# EAGLE design lightAlarm_v4 (EAGLE 8.4.1)

## Sheet 1 of 2
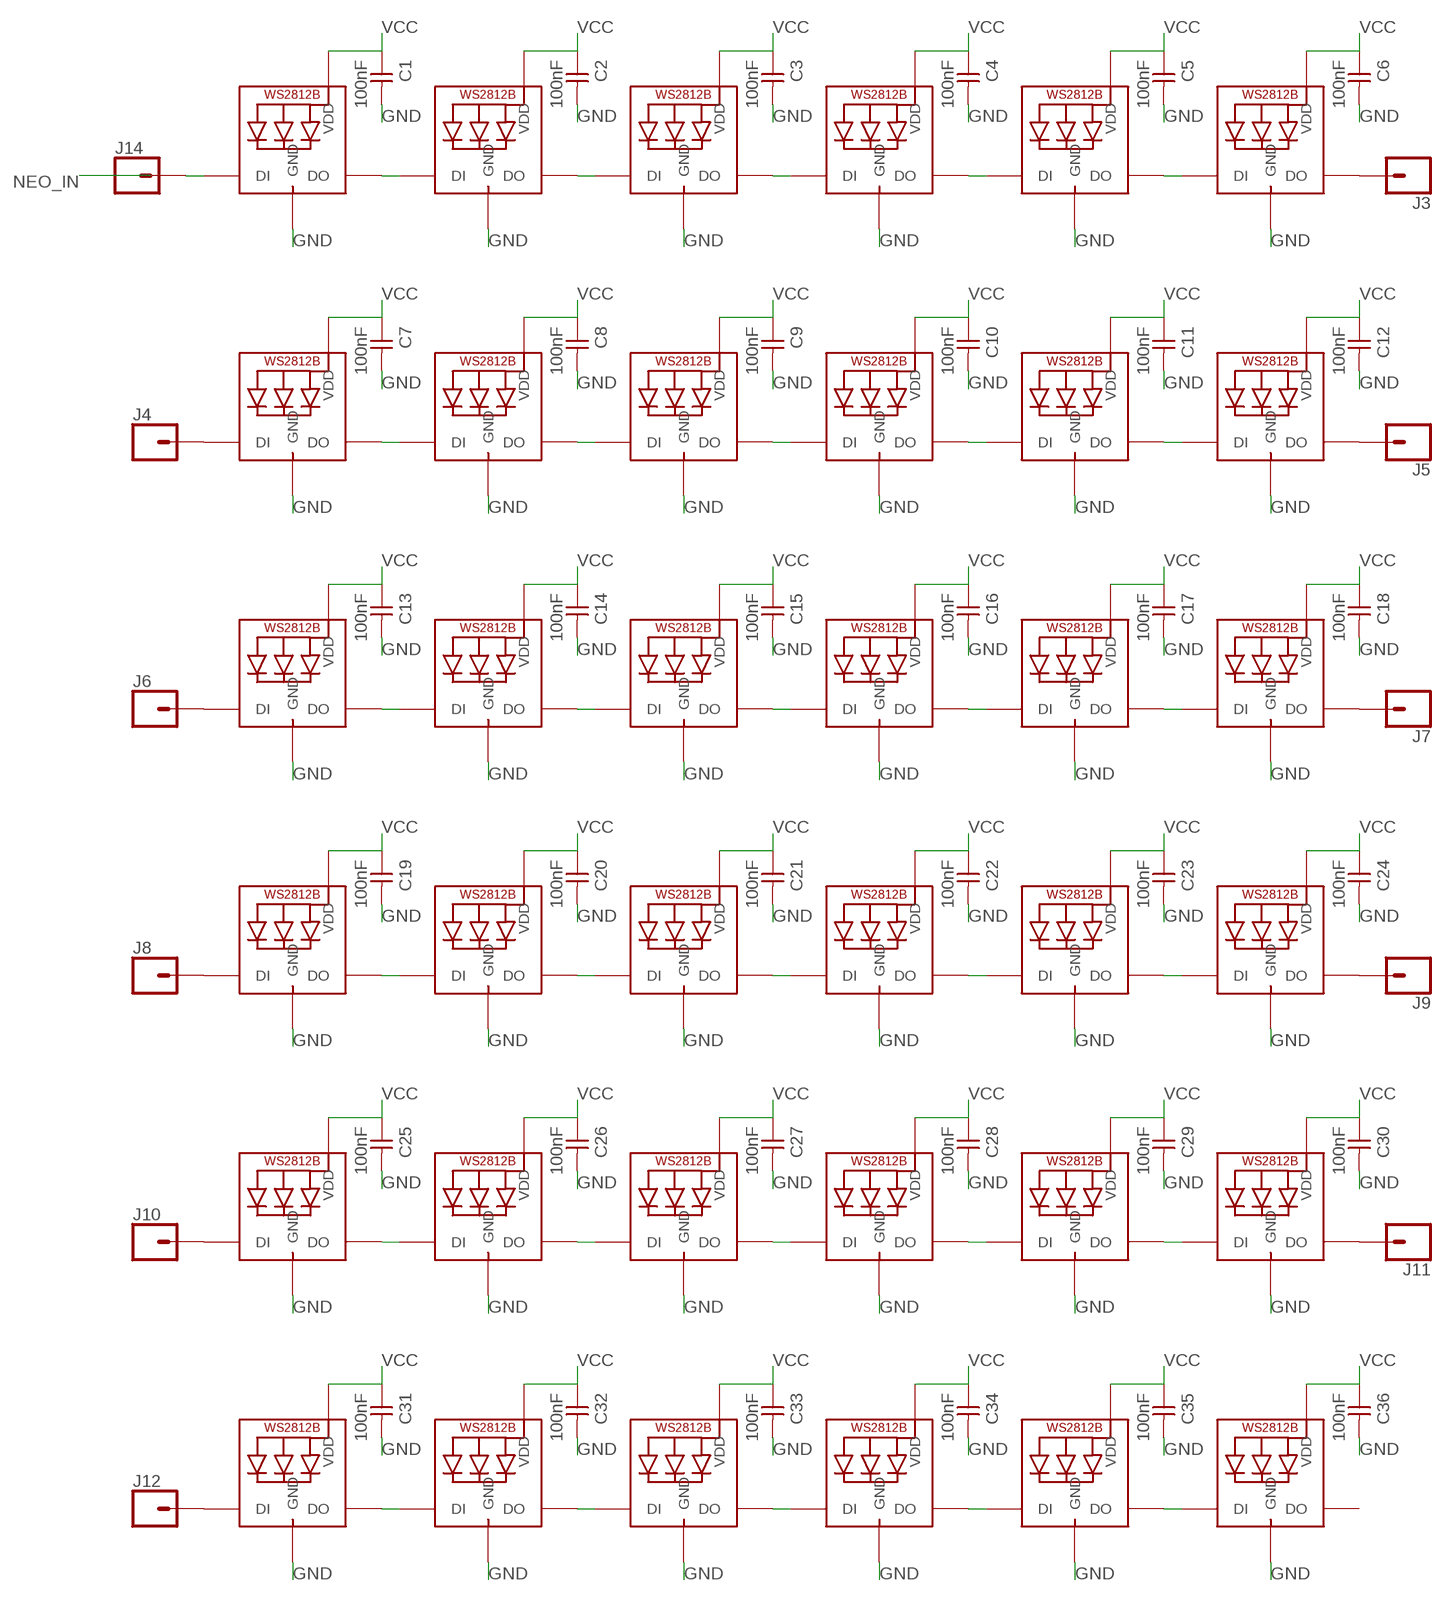
[diagram p0: schematic, sheet 1]

### Parts
C1  100nF  UNPOLARIZED_CAPACITOR1206  [1206]
C2  100nF  UNPOLARIZED_CAPACITOR1206  [1206]
C3  100nF  UNPOLARIZED_CAPACITOR1206  [1206]
C4  100nF  UNPOLARIZED_CAPACITOR1206  [1206]
C5  100nF  UNPOLARIZED_CAPACITOR1206  [1206]
C6  100nF  UNPOLARIZED_CAPACITOR1206  [1206]
C7  100nF  UNPOLARIZED_CAPACITOR1206  [1206]
C8  100nF  UNPOLARIZED_CAPACITOR1206  [1206]
C9  100nF  UNPOLARIZED_CAPACITOR1206  [1206]
C10  100nF  UNPOLARIZED_CAPACITOR1206  [1206]
C11  100nF  UNPOLARIZED_CAPACITOR1206  [1206]
C12  100nF  UNPOLARIZED_CAPACITOR1206  [1206]
C13  100nF  UNPOLARIZED_CAPACITOR1206  [1206]
C14  100nF  UNPOLARIZED_CAPACITOR1206  [1206]
C15  100nF  UNPOLARIZED_CAPACITOR1206  [1206]
C16  100nF  UNPOLARIZED_CAPACITOR1206  [1206]
C17  100nF  UNPOLARIZED_CAPACITOR1206  [1206]
C18  100nF  UNPOLARIZED_CAPACITOR1206  [1206]
C19  100nF  UNPOLARIZED_CAPACITOR1206  [1206]
C20  100nF  UNPOLARIZED_CAPACITOR1206  [1206]
C21  100nF  UNPOLARIZED_CAPACITOR1206  [1206]
C22  100nF  UNPOLARIZED_CAPACITOR1206  [1206]
C23  100nF  UNPOLARIZED_CAPACITOR1206  [1206]
C24  100nF  UNPOLARIZED_CAPACITOR1206  [1206]
C25  100nF  UNPOLARIZED_CAPACITOR1206  [1206]
C26  100nF  UNPOLARIZED_CAPACITOR1206  [1206]
C27  100nF  UNPOLARIZED_CAPACITOR1206  [1206]
C28  100nF  UNPOLARIZED_CAPACITOR1206  [1206]
C29  100nF  UNPOLARIZED_CAPACITOR1206  [1206]
C30  100nF  UNPOLARIZED_CAPACITOR1206  [1206]
C31  100nF  UNPOLARIZED_CAPACITOR1206  [1206]
C32  100nF  UNPOLARIZED_CAPACITOR1206  [1206]
C33  100nF  UNPOLARIZED_CAPACITOR1206  [1206]
C34  100nF  UNPOLARIZED_CAPACITOR1206  [1206]
C35  100nF  UNPOLARIZED_CAPACITOR1206  [1206]
C36  100nF  UNPOLARIZED_CAPACITOR1206  [1206]
J3  CONN_01PTH_LONGPAD  [1X01_LONGPAD]
J4  CONN_01PTH_LONGPAD  [1X01_LONGPAD]
J5  CONN_01PTH_LONGPAD  [1X01_LONGPAD]
J6  CONN_01PTH_LONGPAD  [1X01_LONGPAD]
J7  CONN_01PTH_LONGPAD  [1X01_LONGPAD]
J8  CONN_01PTH_LONGPAD  [1X01_LONGPAD]
J9  CONN_01PTH_LONGPAD  [1X01_LONGPAD]
J10  CONN_01PTH_LONGPAD  [1X01_LONGPAD]
J11  CONN_01PTH_LONGPAD  [1X01_LONGPAD]
J12  CONN_01PTH_LONGPAD  [1X01_LONGPAD]
J14  CONN_01PTH_LONGPAD  [1X01_LONGPAD]
LED1  WS2812B5050  [WS2812B]
LED2  WS2812B5050  [WS2812B]
LED3  WS2812B5050  [WS2812B]
LED4  WS2812B5050  [WS2812B]
LED5  WS2812B5050  [WS2812B]
LED6  WS2812B5050  [WS2812B]
LED7  WS2812B5050  [WS2812B]
LED8  WS2812B5050  [WS2812B]
LED9  WS2812B5050  [WS2812B]
LED10  WS2812B5050  [WS2812B]
LED11  WS2812B5050  [WS2812B]
LED12  WS2812B5050  [WS2812B]
LED13  WS2812B5050  [WS2812B]
LED14  WS2812B5050  [WS2812B]
LED15  WS2812B5050  [WS2812B]
LED16  WS2812B5050  [WS2812B]
LED17  WS2812B5050  [WS2812B]
LED18  WS2812B5050  [WS2812B]
LED19  WS2812B5050  [WS2812B]
LED20  WS2812B5050  [WS2812B]
LED21  WS2812B5050  [WS2812B]
LED22  WS2812B5050  [WS2812B]
LED23  WS2812B5050  [WS2812B]
LED24  WS2812B5050  [WS2812B]
LED25  WS2812B5050  [WS2812B]
LED26  WS2812B5050  [WS2812B]
LED27  WS2812B5050  [WS2812B]
LED28  WS2812B5050  [WS2812B]
LED29  WS2812B5050  [WS2812B]
LED30  WS2812B5050  [WS2812B]
LED31  WS2812B5050  [WS2812B]
LED32  WS2812B5050  [WS2812B]
LED33  WS2812B5050  [WS2812B]
LED34  WS2812B5050  [WS2812B]
LED35  WS2812B5050  [WS2812B]
LED36  WS2812B5050  [WS2812B]

### Nets
GND: C1.2 C2.2 C3.2 C4.2 C5.2 C6.2 C7.2 C8.2 C9.2 C10.2 C11.2 C12.2 C13.2 C14.2 C15.2 C16.2 C17.2 C18.2 C19.2 C20.2 C21.2 C22.2 C23.2 C24.2 C25.2 C26.2 C27.2 C28.2 C29.2 C30.2 C31.2 C32.2 C33.2 C34.2 C35.2 C36.2 LED1.3-GND(GND) LED2.3-GND(GND) LED3.3-GND(GND) LED4.3-GND(GND) LED5.3-GND(GND) LED6.3-GND(GND) LED7.3-GND(GND) LED8.3-GND(GND) LED9.3-GND(GND) LED10.3-GND(GND) LED11.3-GND(GND) LED12.3-GND(GND) LED13.3-GND(GND) LED14.3-GND(GND) LED15.3-GND(GND) LED16.3-GND(GND) LED17.3-GND(GND) LED18.3-GND(GND) LED19.3-GND(GND) LED20.3-GND(GND) LED21.3-GND(GND) LED22.3-GND(GND) LED23.3-GND(GND) LED24.3-GND(GND) LED25.3-GND(GND) LED26.3-GND(GND) LED27.3-GND(GND) LED28.3-GND(GND) LED29.3-GND(GND) LED30.3-GND(GND) LED31.3-GND(GND) LED32.3-GND(GND) LED33.3-GND(GND) LED34.3-GND(GND) LED35.3-GND(GND) LED36.3-GND(GND) ; also sheet 2
N$1: LED1.2-DOUT(DO) LED2.4-DIN(DI)
N$2: LED3.2-DOUT(DO) LED4.4-DIN(DI)
N$3: LED2.2-DOUT(DO) LED3.4-DIN(DI)
N$4: LED5.2-DOUT(DO) LED6.4-DIN(DI)
N$5: LED4.2-DOUT(DO) LED5.4-DIN(DI)
N$6: LED7.2-DOUT(DO) LED8.4-DIN(DI)
N$7: LED9.2-DOUT(DO) LED10.4-DIN(DI)
N$8: LED8.2-DOUT(DO) LED9.4-DIN(DI)
N$9: LED11.2-DOUT(DO) LED12.4-DIN(DI)
N$10: LED10.2-DOUT(DO) LED11.4-DIN(DI)
N$12: LED13.2-DOUT(DO) LED14.4-DIN(DI)
N$13: LED15.2-DOUT(DO) LED16.4-DIN(DI)
N$14: LED14.2-DOUT(DO) LED15.4-DIN(DI)
N$15: LED17.2-DOUT(DO) LED18.4-DIN(DI)
N$16: LED16.2-DOUT(DO) LED17.4-DIN(DI)
N$17: LED19.2-DOUT(DO) LED20.4-DIN(DI)
N$18: LED21.2-DOUT(DO) LED22.4-DIN(DI)
N$19: LED20.2-DOUT(DO) LED21.4-DIN(DI)
N$20: LED23.2-DOUT(DO) LED24.4-DIN(DI)
N$21: LED22.2-DOUT(DO) LED23.4-DIN(DI)
N$22: LED25.2-DOUT(DO) LED26.4-DIN(DI)
N$23: LED27.2-DOUT(DO) LED28.4-DIN(DI)
N$24: LED26.2-DOUT(DO) LED27.4-DIN(DI)
N$25: LED29.2-DOUT(DO) LED30.4-DIN(DI)
N$26: LED28.2-DOUT(DO) LED29.4-DIN(DI)
N$27: LED31.2-DOUT(DO) LED32.4-DIN(DI)
N$28: LED33.2-DOUT(DO) LED34.4-DIN(DI)
N$29: LED32.2-DOUT(DO) LED33.4-DIN(DI)
N$30: LED35.2-DOUT(DO) LED36.4-DIN(DI)
N$31: LED34.2-DOUT(DO) LED35.4-DIN(DI)
N$50: J3.1 LED6.2-DOUT(DO)
N$51: J5.1 LED12.2-DOUT(DO)
N$52: J6.1 LED13.4-DIN(DI)
N$53: J7.1 LED18.2-DOUT(DO)
N$54: J8.1 LED19.4-DIN(DI)
N$55: J9.1 LED24.2-DOUT(DO)
N$56: J10.1 LED25.4-DIN(DI)
N$57: J11.1 LED30.2-DOUT(DO)
N$58: J12.1 LED31.4-DIN(DI)
N$68: J14.1 LED1.4-DIN(DI)
ROW1: J4.1 LED7.4-DIN(DI)
VCC: C1.1 C2.1 C3.1 C4.1 C5.1 C6.1 C7.1 C8.1 C9.1 C10.1 C11.1 C12.1 C13.1 C14.1 C15.1 C16.1 C17.1 C18.1 C19.1 C20.1 C21.1 C22.1 C23.1 C24.1 C25.1 C26.1 C27.1 C28.1 C29.1 C30.1 C31.1 C32.1 C33.1 C34.1 C35.1 C36.1 LED1.1-VDD(VDD) LED2.1-VDD(VDD) LED3.1-VDD(VDD) LED4.1-VDD(VDD) LED5.1-VDD(VDD) LED6.1-VDD(VDD) LED7.1-VDD(VDD) LED8.1-VDD(VDD) LED9.1-VDD(VDD) LED10.1-VDD(VDD) LED11.1-VDD(VDD) LED12.1-VDD(VDD) LED13.1-VDD(VDD) LED14.1-VDD(VDD) LED15.1-VDD(VDD) LED16.1-VDD(VDD) LED17.1-VDD(VDD) LED18.1-VDD(VDD) LED19.1-VDD(VDD) LED20.1-VDD(VDD) LED21.1-VDD(VDD) LED22.1-VDD(VDD) LED23.1-VDD(VDD) LED24.1-VDD(VDD) LED25.1-VDD(VDD) LED26.1-VDD(VDD) LED27.1-VDD(VDD) LED28.1-VDD(VDD) LED29.1-VDD(VDD) LED30.1-VDD(VDD) LED31.1-VDD(VDD) LED32.1-VDD(VDD) LED33.1-VDD(VDD) LED34.1-VDD(VDD) LED35.1-VDD(VDD) LED36.1-VDD(VDD) ; also sheet 2
Unconnected: LED36.2-DOUT(DO)

## Sheet 2 of 2
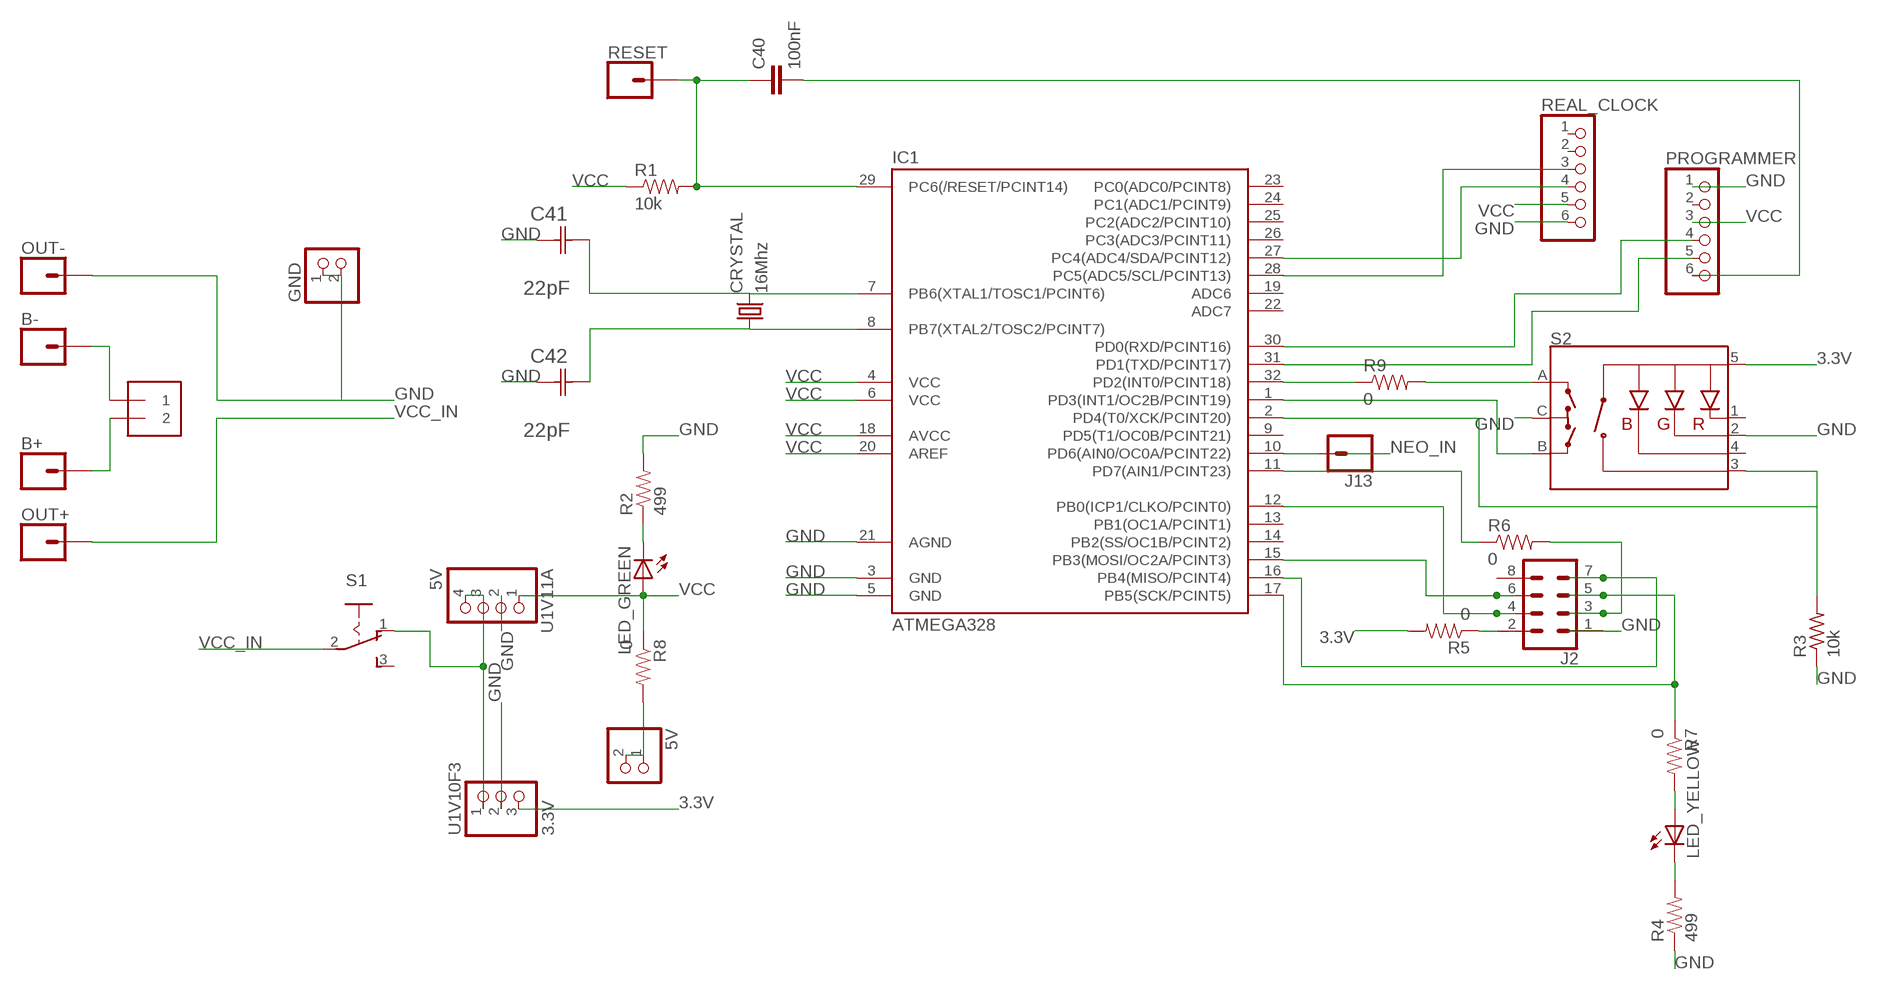
[diagram p1: schematic, sheet 2]

### Parts
5V  PINHD-1X2  [1X02]
B+  CONN_01PTH_LONGPAD  [1X01_LONGPAD]
B-  CONN_01PTH_LONGPAD  [1X01_LONGPAD]
C40  100nF  CAP1206  [1206]
C41  22pF  0612ZC225MAT2A  [CAPC3216X178N]
C42  22pF  0612ZC225MAT2A  [CAPC3216X178N]
CRYSTAL  16Mhz  CSM-7X-DU  [CSM-7X-DU]
GND  PINHD-1X2  [1X02]
IC1  ATMEGA328  ATMEGA48/88/168-AU  [TQFP32-08]
J1  1X2-3.5MM  [1X2-3.5MM]
J2  CONN_04X2  [2X4]
J13  CONN_01PTH_LONGPAD  [1X01_LONGPAD]
LED_GREEN  LED1206  [1206]
LED_YELLOW  LED1206  [1206]
OUT+  CONN_01PTH_LONGPAD  [1X01_LONGPAD]
OUT-  CONN_01PTH_LONGPAD  [1X01_LONGPAD]
PROGRAMMER  PINHD-1X6  [1X06]
R1  10k  RESISTOR1206  [1206]
R2  499  RESISTOR1206  [1206]
R3  10k  RESISTOR1206  [1206]
R4  499  RESISTOR1206  [1206]
R5  0  RESISTOR1206  [1206]
R6  0  RESISTOR1206  [1206]
R7  0  RESISTOR1206  [1206]
R8  0  RESISTOR1206  [1206]
R9  0  RESISTOR1206  [1206]
REAL_CLOCK  PINHD-1X6  [1X06]
RESET  CONN_01PTH_LONGPAD  [1X01_LONGPAD]
S1  255SB  [255SB]
S2  ENCODER-RGB-SWITCH  [ENCODER_LED_3]
U1V10F3  3.3V  PINHD-1X3  [1X03]
U1V11A  5V  PINHD-1X4  [1X04]

### Nets
3.3V: J2.2 R5.1 R5.2 S2.5(+) U1V10F3.3
GND: C41.1(C1) C42.1(C1) GND.1 GND.2 IC1.21(AGND) J2.1 OUT-.1 PROGRAMMER.1 R2.2 R3.1 R4.1 REAL_CLOCK.6 S2.2(-G) S2.C U1V10F3.2 U1V11A.2 ; also sheet 1
N$11: B+.1 J1.2
N$32: LED_GREEN.2(C) R2.1
N$33: S1.1(O) U1V10F3.1 U1V11A.3 U1V11A.4
N$34: C41.2(C2) CRYSTAL.2 IC1.7(PB6(XTAL1/TOSC1/PCINT6))
N$35: C42.2(C2) CRYSTAL.1 IC1.8(PB7(XTAL2/TOSC2/PCINT7))
N$36: IC1.11(PD7(AIN1/PCINT23)) R6.1
N$37: IC1.12(PB0(ICP1/CLKO/PCINT0)) J2.4
N$38: IC1.17(PB5(SCK/PCINT5)) J2.5 LED_YELLOW.1(A) R7.1 R7.2
N$39: IC1.15(PB3(MOSI/OC2A/PCINT3)) J2.6
N$40: IC1.16(PB4(MISO/PCINT4)) J2.7
N$41: B-.1 J1.1
N$42: IC1.27(PC4(ADC4/SDA/PCINT12)) REAL_CLOCK.4
N$43: IC1.28(PC5(ADC5/SCL/PCINT13)) REAL_CLOCK.3
N$44: IC1.30(PD0(RXD/PCINT16)) PROGRAMMER.4
N$45: IC1.31(PD1(TXD/PCINT17)) PROGRAMMER.5
N$46: IC1.32(PD2(INT0/PCINT18)) R9.1 R9.2 S2.A
N$47: IC1.1(PD3(INT1/OC2B/PCINT19)) S2.B
N$48: IC1.2(PD4(T0/XCK/PCINT20)) R3.2 S2.3(SW)
N$49: LED_YELLOW.2(C) R4.2
N$59: J2.3 R6.2
N$61: C40.1 R1.2 RESET.1
N$65: C40.2 PROGRAMMER.6
N$66: IC1.10(PD6(AIN0/OC0A/PCINT22)) J13.1
VCC: 5V.1 5V.2 IC1.4(VCC) LED_GREEN.1(A) PROGRAMMER.3 R1.1 R8.1 R8.2 REAL_CLOCK.5 U1V11A.1 ; also sheet 1
VCC_IN: OUT+.1 S1.2(P)
Unconnected: IC1.9(PD5(T1/OC0B/PCINT21)) IC1.13(PB1(OC1A/PCINT1)) IC1.14(PB2(SS/OC1B/PCINT2)) IC1.18(AVCC) IC1.19(ADC6) IC1.20(AREF) IC1.22(ADC7) IC1.23(PC0(ADC0/PCINT8)) IC1.24(PC1(ADC1/PCINT9)) IC1.25(PC2(ADC2/PCINT10)) IC1.26(PC3(ADC3/PCINT11)) IC1.29(PC6(/RESET/PCINT14)) J2.8 PROGRAMMER.2 REAL_CLOCK.1 REAL_CLOCK.2 S1.3(S) S2.1(-R) S2.4(-B)

## Power pins joined to a net without a drawn wire
GND: IC1.3(GND) IC1.5(GND)
VCC: IC1.6(VCC)

## Library data of the parts
5V GND = pinhead:PINHD-1X2: PIN HEADER
B+ B- J3-J14 OUT+ OUT- RESET = SparkFun-Connectors:CONN_01: Single connection point. Often used as Generic Header-pin footprint for 0.1 inch spaced/style header connections On any of the 0.1 inch spaced packages, you can populate with these: Break Away Headers - Straight <https://www.sparkfun.com/products/116> (PRT-00116) Break Away Male Headers - Right Angle <https://www.sparkfun.com/products/553> (PRT-00553) Female Headers <https://www.sparkfun.com/products/115> (PRT-00115) Break Away Headers - Machine Pin <https://www.sparkfun.com/products/117> (PRT-00117) Break Away Female Headers - Swiss Machine Pin <https://www.sparkfun.com/products/743> (PRT-00743) This device is also useful as a general connection point to wire up your design to another part of your project. Our various solder wires solder well into these plated through hole pads. Hook-Up Wire - Assortment (Stranded, 22 AWG) <https://www.sparkfun.com/products/11375> (PRT-11375) Hook-Up Wire - Assortment (Solid Core, 22 AWG) <https://www.sparkfun.com/products/11367> (PRT-11367) View the entire wire category on our website here <https://www.sparkfun.com/categories/141> Special notes: SMTSO-256-ET is a "flush mount" nut for a 4-40 screw. We mostly use this on specialty testbeds; it is a nice way to connect hardware to your PCB at an adjustable hieght. Also note, the SNAP packages are for using a snappable style connector. We sell a baggie of snaps and they are also used on two LilyPad designs: Snap Assortment - 30 pack (male and female) <https://www.sparkfun.com/products/11347> (DEV-11347) LilyPad Arduino SimpleSnap <https://www.sparkfun.com/products/10941> (DEV-10941) LilyPad SimpleSnap Protoboard <https://www.sparkfun.com/products/10940> (DEV-10940)
C1-C36 = FAB_Hello:UNPOLARIZED_CAPACITOR: unpolarized_capacitor
C40 = 01_SparkFun:CAP: Capacitor Standard 0603 ceramic capacitor, and 0.1" leaded capacitor.
C41 C42 = AVX_By_element14_Batch_1:0612ZC225MAT2A: Capacitor 1206; MPN: 0612ZC225MAT2A; OC_FARNELL: -; OC_NEWARK: 12N3209; SUPPLIER: AVX; TOLERANCE: ±20%; VALUE: 2.2µF; VOLTAGERATING: 10V
CRYSTAL = 01_FAB_Hello:CSM-7X-DU: SMD CRYSTAL Source: www.ecsxtal.com .. Crystal 3.6864MHz CSM_7X_DU.PDF; OC_FARNELL: unknown; OC_NEWARK: unknown
IC1 = satshakit_cnc:ATMEGA48/88/168
J1 = adafruit:1X2: 3.5mm Terminal block http://www.ladyada.net/library/pcb/eaglelibrary.html
J2 = SparkFun-Connectors:CONN_04X2: Multi connection point. Often used as Generic Header-pin footprint for 0.1 inch spaced/style header connections On any of the 0.1 inch spaced packages, you can populate with these: Break Away Headers - Straight <https://www.sparkfun.com/products/116> (PRT-00116) Break Away Male Headers - Right Angle <https://www.sparkfun.com/products/553> (PRT-00553) Female Headers <https://www.sparkfun.com/products/115> (PRT-00115) Break Away Headers - Machine Pin <https://www.sparkfun.com/products/117> (PRT-00117) Break Away Female Headers - Swiss Machine Pin <https://www.sparkfun.com/products/743> (PRT-00743)
LED1-LED36 = adafruit:WS2812B
LED_GREEN LED_YELLOW = 01_FAB_Hello:LED
PROGRAMMER REAL_CLOCK = pinhead:PINHD-1X6: PIN HEADER
R1 R2 R4-R9 = 01_SparkFun:RESISTOR: Resistor Basic schematic elements and footprints for 0603, 1206, and PTH 1/10th watt (small) resistors.
R3 = FAB_Hello:RESISTOR
S1 = switch:255SB: SLIDING SWITCH Distributor Buerklin, 11G810
S2 = SparkFun-Switches:ENCODER-RGB-SWITCH: Illuminated Rotary Encoder w/ RGB LED and select switch Encoders rotate similarly to potentiometers, but they’re different from potentiometers in that an encoder has full rotation without limits. They output gray code so that you can tell how much and in which direction the encoder has been turned. This encoder includes an RGB LED and a push-down select switch. Part #: Top Up EC12PLRGBSDVBF-D <http://top-up.so-buy.com/front/bin/ptdetail.phtml?Part=EC12PLRGBSDVBF-D> SparkFun Products Rotary Encoder - Illuminated (RGB) <https://www.sparkfun.com/products/10982> (COM-10982); PROD_ID: RES-10859; SF_SKU: COM-10982
U1V10F3 = pinhead:PINHD-1X3: PIN HEADER
U1V11A = pinhead:PINHD-1X4: PIN HEADER

## Board
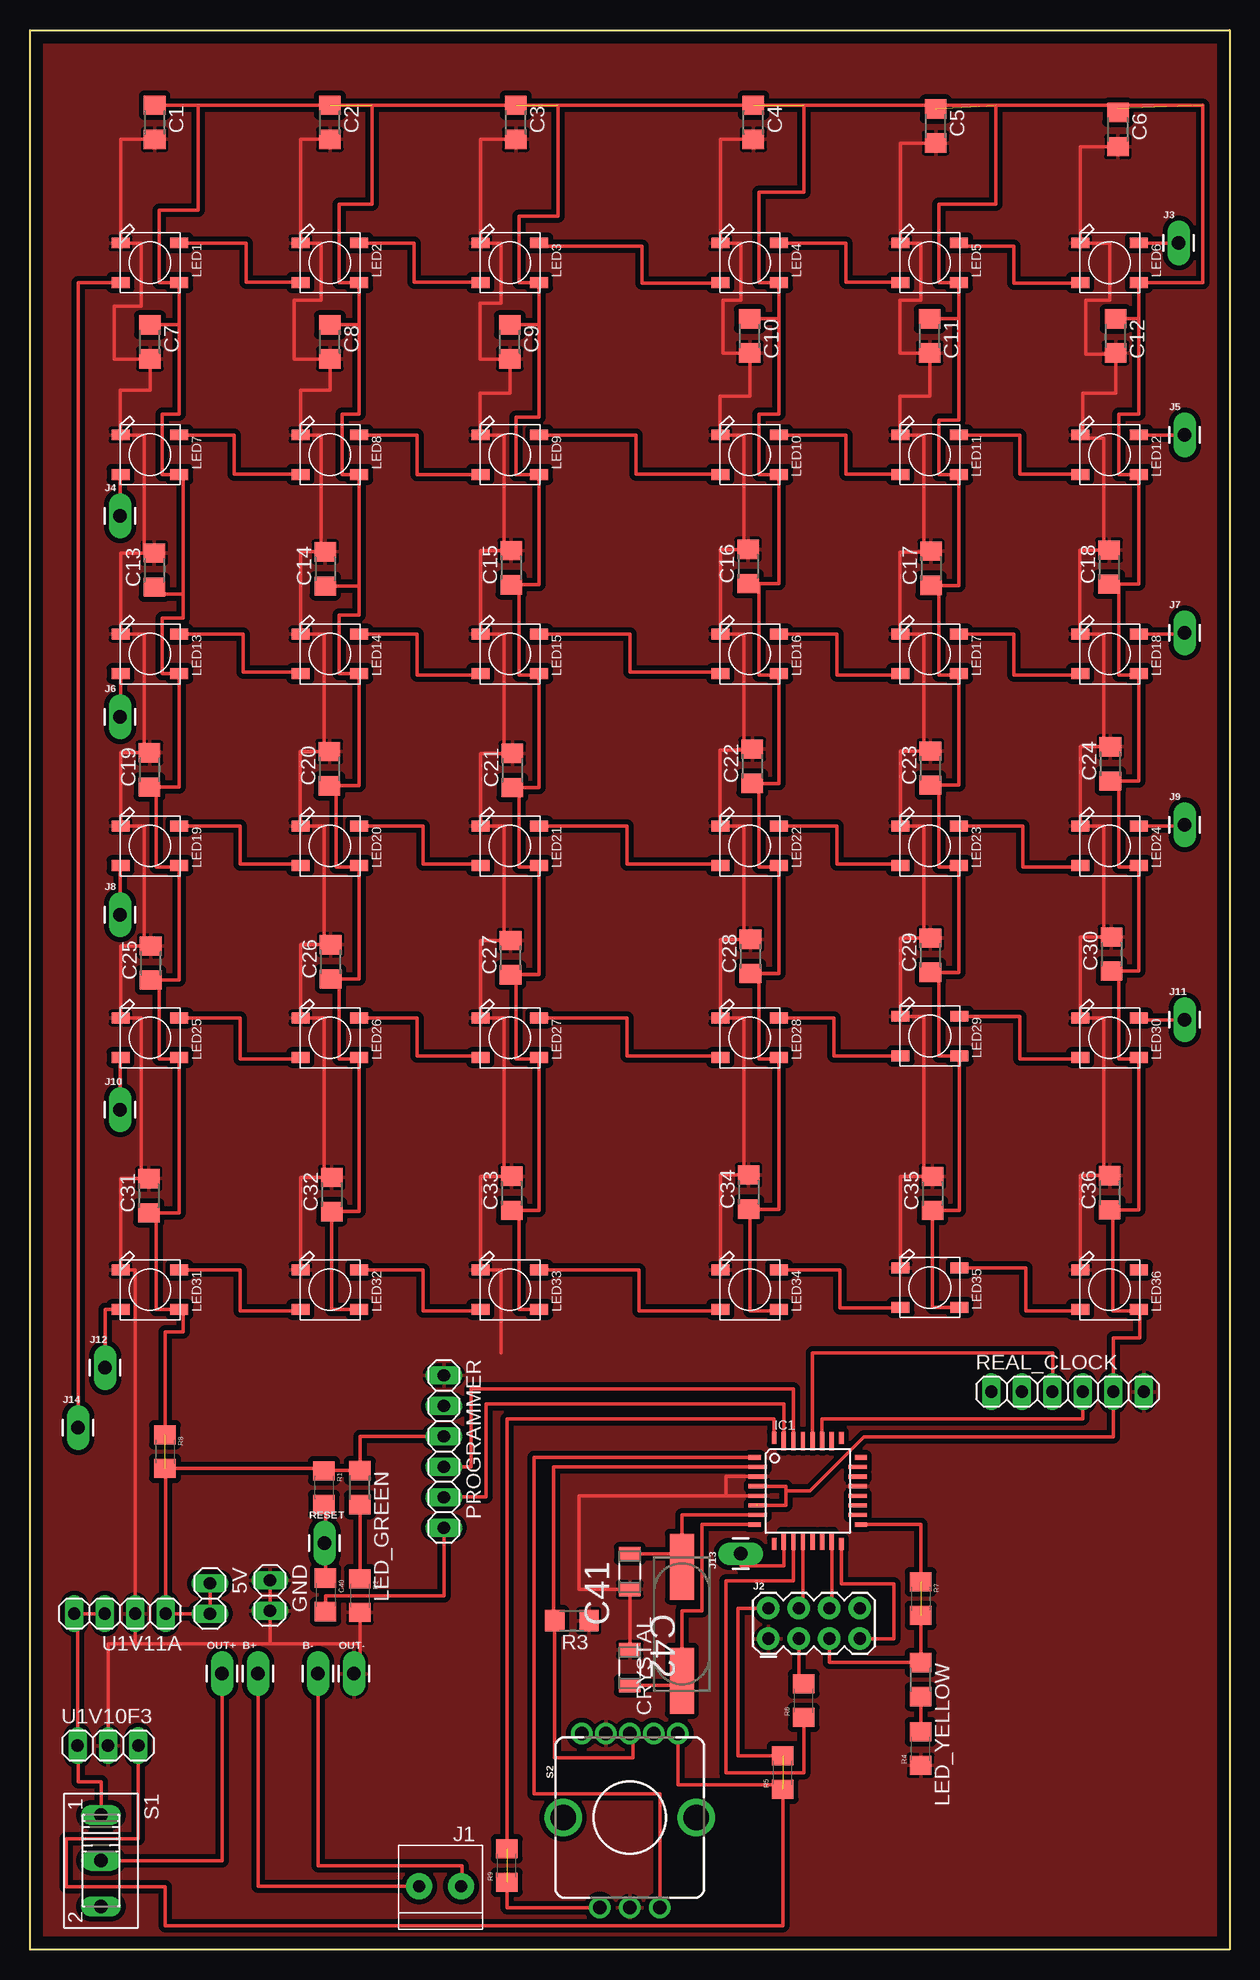
[diagram p2: board, top side]
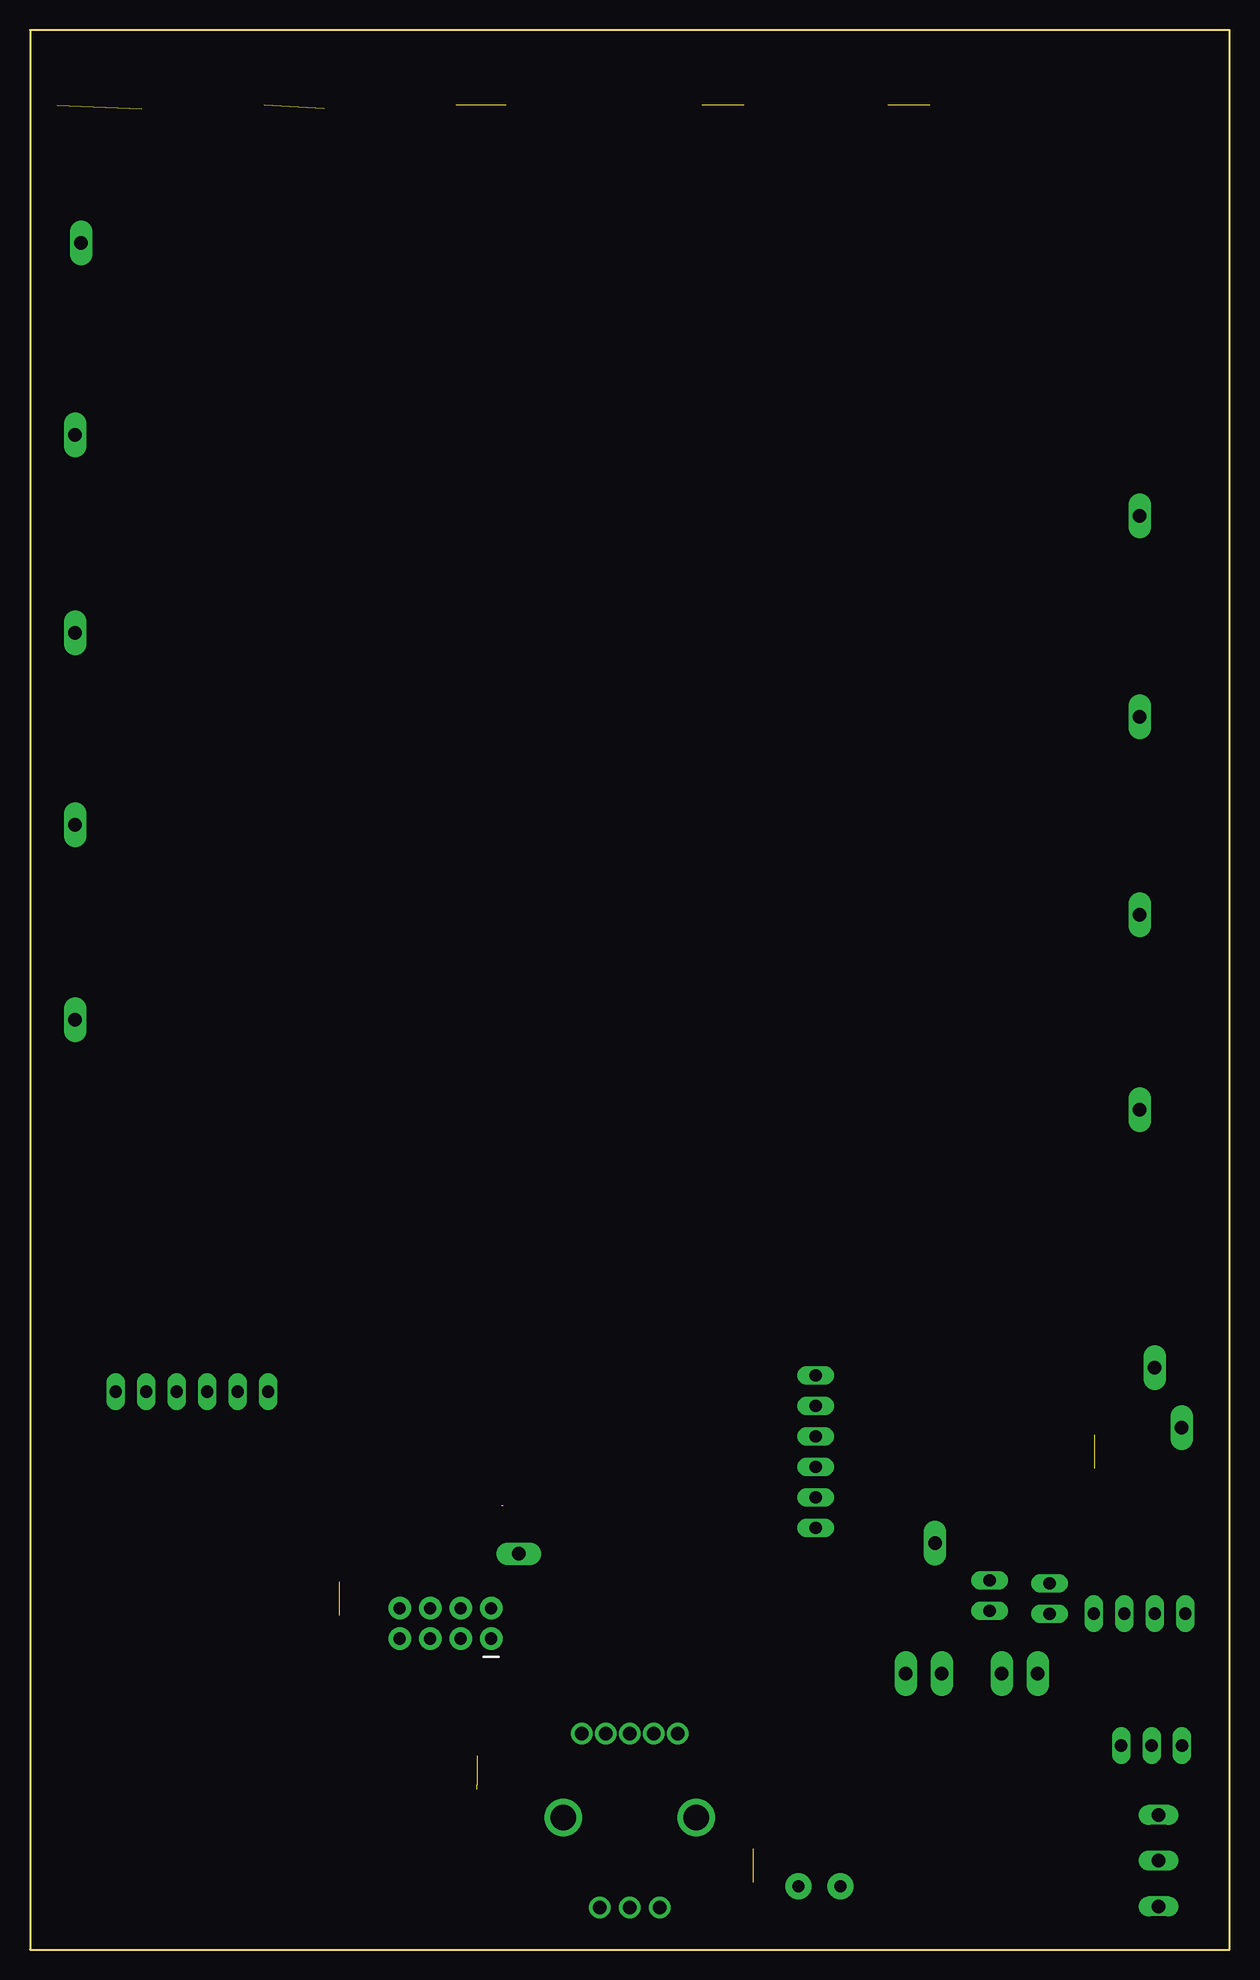
[diagram p3: board, bottom side, seen from below]

Size 100 x 160 mm. Coordinates in mm from the lower left corner, seen from the top.
Outline: 0,160 100,160 100,0 0,0 0,160
Copper layers (1*16): Top 0.035mm / dielectric 1.5mm / Bottom 0.035mm
Design rules "default": minimum track width 6mil, minimum drill 0.35mm, track to track 6mil, track to pad 6mil, pad to pad 6mil, via to via 6mil, smd to smd 6mil, copper to edge 40mil, drill to drill 6mil, minimum pad ring 10mil, minimum via ring 8mil, stop-mask expansion 4mil, vias tented up to drill 0mil, thermal gap 10mil

### Footprints (pad centres in the part's own frame; a part is rotated, then mirrored left to right if it is on the bottom)
1X02 = drill 1.016 long: 1 -1.27,0; 2 1.27,0
1X01_LONGPAD = drill 1.118 pad 1.88 long: 1 0,0
1206 = smd 1.6 x 1.803: 1 -1.422,0; 2 1.422,0
1206' = smd 1.6 x 1.8: 1 -1.4,0; 2 1.4,0
CAPC3216X178N = smd 1.118 x 1.803: 1 -1.499,0; 2 1.499,0
CSM-7X-DU = smd 5.5 x 2: 1 -4.75,0; 2 4.75,0
TQFP32-08 = smd 1.016 x 0.406: 1 -4.42,2.8; 8 -4.42,-2.8; 17 4.42,-2.8; 24 4.42,2.8 | smd 1.524 x 0.356: 2 -4.166,2; 3 -4.166,1.2; 4 -4.166,0.4; 5 -4.166,-0.4; 6 -4.166,-1.2; 7 -4.166,-2; 18 4.166,-2; 19 4.166,-1.2; 20 4.166,-0.4; 21 4.166,0.4; 22 4.166,1.2; 23 4.166,2 | smd 0.406 x 1.016: 9 -2.8,-4.42; 16 2.8,-4.42; 25 2.8,4.42; 32 -2.8,4.42 | smd 0.356 x 1.524: 10 -2,-4.166; 11 -1.2,-4.166; 12 -0.4,-4.166; 13 0.4,-4.166; 14 1.2,-4.166; 15 2,-4.166; 26 2,4.166; 27 1.2,4.166; 28 0.4,4.166; 29 -0.4,4.166; 30 -1.2,4.166; 31 -2,4.166
1X2-3.5MM = drill 1 pad 2.184: 1 1.8,0; 2 -1.7,0
2X4 = drill 1.016 pad 1.88: 1 -3.81,-1.27; 2 -3.81,1.27; 3 -1.27,-1.27; 4 -1.27,1.27; 5 1.27,-1.27; 6 1.27,1.27; 7 3.81,-1.27; 8 3.81,1.27
WS2812B = smd 1.5 x 0.9: 1-VDD 2.45,-1.65; 2-DOUT 2.45,1.65; 3-GND -2.45,1.65; 4-DIN -2.45,-1.65
1X06 = drill 1.016 long: 1 -6.35,0; 2 -3.81,0; 3 -1.27,0; 4 1.27,0; 5 3.81,0; 6 6.35,0
255SB = drill 1.118 long: 1 -3.81,0; 2 0,0; 3 3.81,0
ENCODER_LED_3 = drill 1.1 pad 1.778: 1 -4,7; 2 -2,7; 3 0,7; 4 2,7; 5 4,7 | drill 1.1 pad 1.8: A -2.5,-7.5; B 2.5,-7.5; C 0,-7.5 | drill 2.1: M1 -5.55,0; M2 5.55,0
1X03 = drill 1.016 long: 1 -2.54,0; 2 0,0; 3 2.54,0
1X04 = drill 1.016 long: 1 -3.81,0; 2 -1.27,0; 3 1.27,0; 4 3.81,0

### Placement (x,y rotation side)
5V  15,29.25 270 top
B+  19,23 0 top
B-  24,23 0 top
C1  10.4,152.3 270 top
C2  25,152.3 270 top
C3  40.5,152.3 270 top
C4  60.3,152.3 270 top
C5  75.5,152 270 top
C6  90.7,151.7 270 top
C7  10,134 270 top
C8  25,134 270 top
C9  40,134 270 top
C10  60,134.5 270 top
C11  75,134.5 270 top
C12  90.5,134.5 270 top
C13  10.36,114.98 90 top
C14  24.61,115.08 90 top
C15  40.11,115.18 90 top
C16  59.86,115.28 90 top
C17  75.11,115.13 90 top
C18  89.96,115.23 90 top
C19  9.96,98.33 90 top
C20  24.96,98.43 90 top
C21  40.21,98.28 90 top
C22  60.21,98.63 90 top
C23  75.06,98.48 90 top
C24  90.06,98.83 90 top
C25  10.06,82.23 90 top
C26  25.06,82.33 90 top
C27  40.06,82.68 90 top
C28  60.06,82.78 90 top
C29  75.06,82.88 90 top
C30  90.16,82.98 90 top
C31  9.91,62.83 90 top
C32  25.16,62.93 90 top
C33  40.16,63.03 90 top
C34  59.91,63.13 90 top
C35  75.24,63.02 90 top
C36  90.01,63.08 90 top
C40  100nF  [1206']  24.64,29.56 270 top
C41  50,31.5 90 top
C42  50,23.5 270 top
CRYSTAL  54.34,27.15 90 top
GND  20,29.5 270 top
IC1  64.84,38.22 0 top
J1  34.13,5.28 0 top
J2  65.37,27.18 0 top
J3  95.75,142.25 0 top
J4  7.5,119.5 0 top
J5  96.25,126.25 0 top
J6  7.5,102.75 0 top
J7  96.25,109.75 0 top
J8  7.5,86.25 0 top
J9  96.25,93.75 0 top
J10  7.5,70 0 top
J11  96.25,77.5 0 top
J12  6.25,48.5 0 top
J13  59.25,33 90 top
J14  4,43.5 0 top
LED1  10,140.6 0 top
LED2  25,140.6 0 top
LED3  40,140.6 0 top
LED4  60,140.6 0 top
LED5  75,140.6 0 top
LED6  90,140.6 0 top
LED7  10,124.6 0 top
LED8  25,124.6 0 top
LED9  40,124.6 0 top
LED10  60,124.6 0 top
LED11  75,124.6 0 top
LED12  90,124.6 0 top
LED13  10,108 0 top
LED14  25,108 0 top
LED15  40,108 0 top
LED16  60,108 0 top
LED17  75,108 0 top
LED18  90,108 0 top
LED19  10,92 0 top
LED20  25,92 0 top
LED21  40,92 0 top
LED22  60,92 0 top
LED23  75,92 0 top
LED24  90,92 0 top
LED25  10,76 0 top
LED26  25,76 0 top
LED27  40,76 0 top
LED28  60,76 0 top
LED29  75.03,76.14 0 top
LED30  90,76 0 top
LED31  10,55 0 top
LED32  25,55 0 top
LED33  40,55 0 top
LED34  60,55 0 top
LED35  75.03,55.17 0 top
LED36  90,55 0 top
LED_GREEN  27.5,38.5 270 top
LED_YELLOW  74.25,22.5 270 top
OUT+  16,23 0 top
OUT-  27,23 0 top
PROGRAMMER  34.5,41.5 270 top
R1  10k  [1206']  24.5,38.5 270 top
R2  499  [1206']  27.5,29.5 270 top
R3  45.17,27.41 180 top
R4  499  [1206']  74.25,16.75 90 top
R5  0  [1206']  62.75,14.75 90 top
R6  0  [1206']  64.5,20.75 90 top
R7  0  [1206']  74.25,29.25 270 top
R8  0  [1206']  11.25,41.5 270 top
R9  0  [1206']  39.75,7 90 top
REAL_CLOCK  86.5,46.5 0 top
RESET  24.55,33.87 0 top
S1  5.92,7.4 270 top
S2  50,11 0 top
U1V10F3  6.5,17 0 top
U1V11A  7.5,28 180 top

### Tracks (layer width: path | path; a pad name or v marks a point on that pad's centre or on a via)
3.3V  (2 unrouted)
  Top 0.305: U1V10F3.3 9.04,9.25 3,9.25 3,5.25 11.25,5.25 11.25,2 61.75,2 62,2 62.75,2 R5.1 | S2.5 54,13.75 62.75,13.75 | J2.2 59,28.45 59,16.15 R5.2
GND
  Top 0.305: C1.2 7.55,150.88 LED1.3-GND 9.25,142.25 9.25,137 7,137 7,132.58 C7.2 10,130 7.5,130 7.5,126.25 LED7.3-GND 9.5,126.25 9.5,116.4 C13.2 7.55,116.4 LED13.3-GND 9.5,109.65 9.5,99.75 C19.2 7.55,99.75 LED19.3-GND 9.5,93.65 9.5,83.75 10.06,83.75 C25.2 7.55,83.65 LED25.3-GND 9.25,77.65 9.25,64 9.91,64 C31.2 7.55,64.25 LED31.3-GND 8.75,56.65 8.75,27.75 8.77,27.75 | C2.2 22.55,150.88 LED2.3-GND 24.25,142.25 24.25,137.5 22,137.5 22,132.58 C8.2 25,130 22.55,130 LED8.3-GND 24.25,126.25 24.25,116.5 C14.2 22.55,116.5 LED14.3-GND 24.5,109.65 24.5,99.75 24.96,99.75 C20.2 22.5,99.85 22.5,93.65 LED20.3-GND 24.5,93.65 24.5,83.75 25.31,83.75 C26.2 22.55,83.75 LED26.3-GND 24.5,77.65 24.5,64.25 25.16,64.25 C32.2 22.55,64.35 LED32.3-GND | C3.2 37.55,150.88 LED3.3-GND 39.25,142.25 39.25,137.25 37.5,137.25 37.5,132.58 C9.2 40,129.75 37.5,129.75 37.5,126.25 LED9.3-GND 39.5,126.25 39.5,116.75 40.11,116.75 C15.2 37.55,116.6 LED15.3-GND 39.5,109.65 39.5,99.75 40.21,99.75 C21.2 37.55,99.7 LED21.3-GND 39.5,93.65 39.5,84 40.06,84 C27.2 37.55,84.1 LED27.3-GND 39.5,77.65 39.5,64.5 40.16,64.5 C33.2 37.55,64.45 LED33.3-GND 39.25,56.65 39.25,49.75 | C4.2 57.55,150.88 LED4.3-GND 59.25,142.25 59.25,137.5 57.75,137.5 57.75,133.08 C10.2 60,129.5 57.5,129.5 57.5,126.25 LED10.3-GND 59.5,126.25 59.5,116.7 C16.2 57.55,116.7 LED16.3-GND 59.5,109.65 59.5,100 | C5.2 72.55,150.58 LED5.3-GND 74.25,142.25 74.25,137.5 72.5,137.5 72.5,133.08 C11.2 75,129.5 72.5,129.5 72.5,126.25 LED11.3-GND 74.5,126.25 74.5,116.55 C17.2 75.11,116.5 72.5,116.5 72.5,109.65 LED17.3-GND 74.5,109.65 74.5,99.75
  Top 0.305: C6.2 87.55,150.28 LED6.3-GND 90,142.25 90,137.5 88,137.5 88,133 90.5,133 | 90.5,133 C12.2 | 90.5,133 90.5,129.75 87.75,129.75 87.75,126.25 LED12.3-GND 87.55,126 89.5,126 89.5,116.65 C18.2 87.5,116.65 87.5,109.65 LED18.3-GND 89.5,109.65 89.5,100.25 C24.2 87.55,100.25 LED24.3-GND 89.5,93.65 89.5,84.25 90.16,84.25 C30.2 87.55,84.4 LED30.3-GND 89.5,77.65 89.5,64.5 C36.2 87.55,64.5 LED36.3-GND | 59.5,100 60.21,100 C22.2 | 59.5,100 57.5,100 57.5,93.65 LED22.3-GND 59.5,93.65 59.5,84 60.31,84 C28.2 57.55,84.2 LED28.3-GND 59.5,77.65 59.5,64.5 59.91,64.5 C34.2 57.55,64.55 LED34.3-GND | C23.2 72.55,99.9 LED23.3-GND 74.5,93.65 74.5,84 75.06,84 C29.2 72.58,84.3 LED29.3-GND 74.5,77.79 74.5,64.5 75.24,64.5 C35.2 72.58,64.44 LED35.3-GND | C42.1 C41.1 45.75,30 45.75,37.82 58,37.82 | GND.1 GND.2 20,25.5 | R2.2 27.5,25.5 | 27.5,25.5 27.5,23 OUT-.1 | 27.5,25.5 20,25.5 | 20,25.5 8.77,25.5 | 8.77,27.75 8.77,25.5 | 8.77,27.75 U1V11A.2 | 8.77,25.5 6.5,25.5 U1V10F3.2 | 93,46.5 REAL_CLOCK.6 | 58,37.82 60.55,37.82 | 60.55,39.42 58,39.42 58,37.82
  pour Top (isolate 0.406): 1,159.25 99.25,159.25 99,1 0.75,1
N$1
  Top 0.305: LED1.2-DOUT 18,142.25 18,139 22.55,139 LED2.4-DIN
N$2
  Top 0.305: LED4.4-DIN 57.55,138.9 51,138.9 51,142 42.45,142 LED3.2-DOUT
N$3
  Top 0.305: 37.55,138.9 LED3.4-DIN 37.55,139 | LED2.2-DOUT 32,142.25 32,139 37.55,139 | 38,139 37.55,139
N$4
  Top 0.305: LED6.4-DIN 87.55,138.9 82,138.9 82,142 77.45,142 LED5.2-DOUT
N$5
  Top 0.305: LED4.2-DOUT 68,142.25 68,139 72.55,139 LED5.4-DIN
N$6
  Top 0.305: LED7.2-DOUT 17,126.25 17,123 22.55,123 LED8.4-DIN
N$7
  Top 0.305: LED9.2-DOUT 50.5,126.25 50.5,123 57.55,123 LED10.4-DIN
N$8
  Top 0.305: LED8.2-DOUT 32.25,126.25 32.25,122.95 LED9.4-DIN
N$9
  Top 0.305: LED11.2-DOUT 82.5,126.25 82.5,123 87.55,123 LED12.4-DIN
N$10
  Top 0.305: LED10.2-DOUT 68,126.25 68,123 72.55,123 LED11.4-DIN
N$11
  Top 0.305: B+.1 19,5.28 J1.2
N$12
  Top 0.305: LED13.2-DOUT 17.75,109.65 17.75,106.5 22.55,106.5 LED14.4-DIN
N$13
  Top 0.305: LED15.2-DOUT 50,109.65 50,106.5 57.55,106.5 LED16.4-DIN
N$14
  Top 0.305: LED14.2-DOUT 32.25,109.65 32.25,106.25 37.55,106.25 LED15.4-DIN
N$15
  Top 0.305: LED17.2-DOUT 82,109.65 82,106.25 87.55,106.25 LED18.4-DIN
N$16
  Top 0.305: LED16.2-DOUT 67.25,109.65 67.25,106.25 72.55,106.25 LED17.4-DIN
N$17
  Top 0.305: LED19.2-DOUT 17.5,93.65 17.5,90.5 22.55,90.5 LED20.4-DIN
N$18
  Top 0.305: LED21.2-DOUT 49.75,93.65 49.75,90.5 57.55,90.5 LED22.4-DIN
N$19
  Top 0.305: LED20.2-DOUT 32.75,93.65 32.75,90.5 37.55,90.5 LED21.4-DIN
N$20
  Top 0.305: LED23.2-DOUT 82.75,93.65 82.75,90.25 87.55,90.25 LED24.4-DIN
N$21
  Top 0.305: LED22.2-DOUT 67.25,93.65 67.25,90.5 72.55,90.5 LED23.4-DIN
N$22
  Top 0.305: LED25.2-DOUT 17.5,77.65 17.5,74.25 22.55,74.25 LED26.4-DIN
N$23
  Top 0.305: LED27.2-DOUT 49.75,77.65 49.75,74.5 57.55,74.5 LED28.4-DIN
N$24
  Top 0.305: LED26.2-DOUT 32.25,77.65 32.25,74.5 37.55,74.5 LED27.4-DIN
N$25
  Top 0.305: LED29.2-DOUT 82.5,77.79 82.5,74.25 87.55,74.25 LED30.4-DIN
N$26
  Top 0.305: LED28.2-DOUT 67,77.65 67,74.5 LED29.4-DIN
N$27
  Top 0.305: LED31.2-DOUT 17.5,56.65 17.5,53.25 22.55,53.25 LED32.4-DIN
N$28
  Top 0.305: LED33.2-DOUT 50.75,56.65 50.75,53.25 57.55,53.25 LED34.4-DIN
N$29
  Top 0.305: LED32.2-DOUT 32.75,56.65 32.75,53.25 37.55,53.25 LED33.4-DIN
N$30
  Top 0.305: LED35.2-DOUT 83,56.82 83,53.25 87.55,53.25 LED36.4-DIN
N$31
  Top 0.305: LED34.2-DOUT 67.5,56.65 67.5,53.5 72.58,53.5 LED35.4-DIN
N$32
  Top 0.305: LED_GREEN.2 R2.1
N$33
  Top 0.305: S1.1 5.92,14 4,14 4,17 U1V10F3.1 3.96,28 U1V11A.4 U1V11A.3
N$34
  Top 0.305: 54,34.5 53.84,34.5 54.18,32.74 | 54.18,32.74 CRYSTAL.2 54.34,36.22 IC1.7 | C41.2 54.75,33 54.18,33 54.18,32.74
N$35
  Top 0.305: 53.84,23.5 CRYSTAL.1 | C42.2 54.34,22 CRYSTAL.1 | 60.25,35.42 IC1.8 56,35.42 56,28.25 54.34,28.25 CRYSTAL.1
N$36
  Top 0.305: R6.1 64.5,14.75 58,14.75 58,30.75 63.64,30.75 IC1.11
N$37
  Top 0.305: IC1.12 64.44,28.45 J2.4
N$38  (1 unrouted)
  Top 0.305: IC1.17 74.25,35.42 R7.1 | J2.5 66.64,23.92 LED_YELLOW.1 R7.2
N$39
  Top 0.305: IC1.15 66.84,28.45 J2.6
N$40
  Top 0.305: J2.7 72,25.91 72,30.5 67.64,30.5 IC1.16
N$41
  Top 0.305: B-.1 24,7 36,7 36,5.28 J1.1
N$42
  Top 0.305: IC1.27 66.04,44.25 87.75,44.25 87.75,46.5 REAL_CLOCK.4
N$43
  Top 0.305: IC1.28 65.24,49.75 85.25,49.75 85.25,46.5 REAL_CLOCK.3
N$44
  Top 0.305: IC1.30 63.64,46.75 36.75,46.75 36.75,40.25 34.5,40.25 PROGRAMMER.4
N$45
  Top 0.305: IC1.31 62.84,45.5 38,45.5 38,37.75 34.5,37.75 PROGRAMMER.5
N$46  (1 unrouted)
  Top 0.305: S2.A 39.75,3.5 R9.1 | IC1.32 62,42.64 62,44.25 39.75,44.25 R9.2
N$47
  Top 0.305: 52.5,5.25 S2.B 52.5,13 42,13 42,41.02 IC1.1
N$48
  Top 0.305: IC1.2 43.66,40.22 43.66,27.5 R3.2 43.75,16 50.25,16 50.25,18 S2.3
N$49
  Top 0.305: LED_YELLOW.2 R4.2
N$50
  Top 0.305: LED6.2-DOUT J3.1
N$51
  Top 0.305: LED12.2-DOUT J5.1
N$52
  Top 0.305: LED13.4-DIN 7.55,102.75 J6.1
N$53
  Top 0.305: LED18.2-DOUT 96.25,109.65 J7.1
N$54
  Top 0.305: LED19.4-DIN 7.5,90.35 J8.1
N$55
  Top 0.305: LED24.2-DOUT 96.25,93.65 J9.1
N$56
  Top 0.305: LED25.4-DIN 7.5,74.35 J10.1
N$57
  Top 0.305: LED30.2-DOUT 92.45,77.5 J11.1
N$58
  Top 0.305: 7.5,53.35 LED31.4-DIN 6.25,53.35 J12.1
N$59
  Top 0.305: J2.3 64.1,22.15 R6.2
N$61
  Top 0.305: R1.2 24.64,37.1 C40.1 24.64,33.87 RESET.1
N$65
  Top 0.305: C40.2 24.64,29.5 34.5,29.5 PROGRAMMER.6
N$66
  Top 0.305: IC1.10 62.84,32 59.25,32 J13.1
N$68
  Top 0.305: LED1.4-DIN 4,138.95 J14.1
ROW1
  Top 0.305: LED7.4-DIN 7.5,122.95 J4.1
VCC  (7 unrouted)
  Top 0.305: 90.7,153.42 C6.1 | 75.5,153.72 C5.1 | 14,153.72 C1.1 | 14,153.72 28.5,153.72 | 28.5,153.72 44,153.72 | 44,153.72 64.5,153.72 | 64.5,153.72 80.5,153.72 | 80.5,153.72 97.75,153.72 97.75,138.95 LED6.1-VDD 92.45,135.92 | 14,153.72 14,145 10.75,145 10.75,138.95 LED1.1-VDD 12.45,135.42 | 28.5,153.72 28.5,145.5 25.75,145.5 25.75,138.95 LED2.1-VDD 27.45,135.42 | 44,153.72 44,144.5 40.75,144.5 40.75,138.95 LED3.1-VDD 42.45,135.42 | 64.5,153.72 64.5,146.5 60.75,146.5 60.75,138.95 LED4.1-VDD 62.45,135.92 | 80.5,153.72 80.5,145.5 75.75,145.5 75.75,138.95 LED5.1-VDD 77.45,135.92 | 12.45,135.42 C7.1 | 12.45,135.42 12.45,128 11,128 11,122.95 LED7.1-VDD 12.75,122.95 12.75,113 | C8.1 27.45,135.42 | 27.45,135.42 27.45,128 26,128 26,122.95 LED8.1-VDD 27.45,113.66 | 42.45,135.42 C9.1 | 42.45,135.42 42.45,127.75 40.5,127.75 40.5,122.95 LED9.1-VDD 42.45,113.76 C15.1 40.75,113.76 40.75,106.25 42.45,106.25 LED15.1-VDD 42.45,96.86 40.75,96.86 | 62.45,135.92 C10.1 | 62.45,135.92 62.45,128 60.75,128 60.75,122.95 LED10.1-VDD 62.45,113.86 60.75,113.86 | 77.45,135.92 C11.1 | 77.45,135.92 77.45,127.5 75.75,127.5 75.75,122.95 LED11.1-VDD 77.45,113.71 C17.1 75.75,113.71 75.75,106.25 77.45,106.25 LED17.1-VDD 77.45,97.06 C23.1 75.75,97.06 75.75,90.25 77.45,90.25 LED23.1-VDD 77.45,81.46 C29.1 75.75,81.46 75.75,74.5 LED29.1-VDD 77.48,61.6 C35.1 75.24,53.52 LED35.1-VDD | 92.45,135.92 C12.1 | 92.45,135.92 92.45,128 90.75,128 90.75,122.95 LED12.1-VDD 92.45,113.81 C18.1 90.75,113.81 90.75,106.25 92.45,106.25 LED18.1-VDD 92.45,97.41 90.75,97.41 | 12.75,113 10.36,113 C13.1 | 12.75,113 12.75,111 11,111 11,106.35 LED13.1-VDD 12.45,96.91 C19.1 10.5,96.91 10.5,90.25 12.45,90.25 LED19.1-VDD 12.45,80.81 C25.1 10.75,80.81 10.75,74.25 12.45,74.25 LED25.1-VDD 12.45,61.41 10.5,61.41
  Top 0.305: C14.1 27.45,113.66 | 27.45,113.66 27.45,111.25 25.75,111.25 25.75,106.35 LED14.1-VDD 27.45,97.01 C20.1 25.5,97.01 25.5,90.25 27.45,90.25 LED20.1-VDD 27.45,80.91 C26.1 25.75,80.91 25.75,74.25 27.45,74.25 LED26.1-VDD 27.45,61.51 C32.1 25.16,53.35 LED32.1-VDD | C16.1 60.75,113.86 | 60.75,113.86 60.75,106.25 62.45,106.25 | 62.45,106.25 LED16.1-VDD | 40.75,96.86 C21.1 | 40.75,96.86 40.75,90.25 42.45,90.25 LED21.1-VDD 42.45,81.26 C27.1 40.5,81.26 40.5,74.25 42.45,74.25 LED27.1-VDD 42.45,61.61 40.75,61.61 | 62.45,106.25 62.45,97.21 C22.1 60.75,97.21 60.75,90.25 62.45,90.25 LED22.1-VDD 62.45,81.36 C28.1 60.75,81.36 60.75,74.25 62.45,74.25 LED28.1-VDD 62.45,61.71 C34.1 60,61.71 60,53.25 62.45,53.25 LED34.1-VDD | 90.75,97.41 C24.1 | 90.75,97.41 90.75,90.25 92.45,90.25 LED24.1-VDD 92.45,81.56 C30.1 90.75,81.56 90.75,74.25 92.45,74.25 LED30.1-VDD 92.45,61.66 C36.1 90.25,61.66 90.25,53.25 92.45,53.25 LED36.1-VDD 92.5,53.35 92.5,51 90.31,51 REAL_CLOCK.5 90.31,42.75 69.5,42.75 65,38.25 63,38.25 | 10.5,61.41 C31.1 | 40.75,61.61 C33.1 | 10.5,61.41 10.5,53.35 LED31.1-VDD 12.75,53.35 12.75,51.5 11.25,51.5 R8.1 | PROGRAMMER.3 27.5,42.77 LED_GREEN.1 24.5,39.92 R1.1 24.5,40.1 R8.2 11.31,40 U1V11A.1 | 11.31,28.23 U1V11A.1 | LED33.1-VDD 40.75,53.35 40.75,61.61 | 60.55,37.02 63,37.02 63,38.25 | IC1.4 63,38.62 63,38.25 | 5V.1 5V.2 14.98,28 U1V11A.1
VCC_IN
  Top 0.305: OUT+.1 16,7.4 S1.2